# Altium project JacdacRp2040DisplayEc30 125.PrjPCB
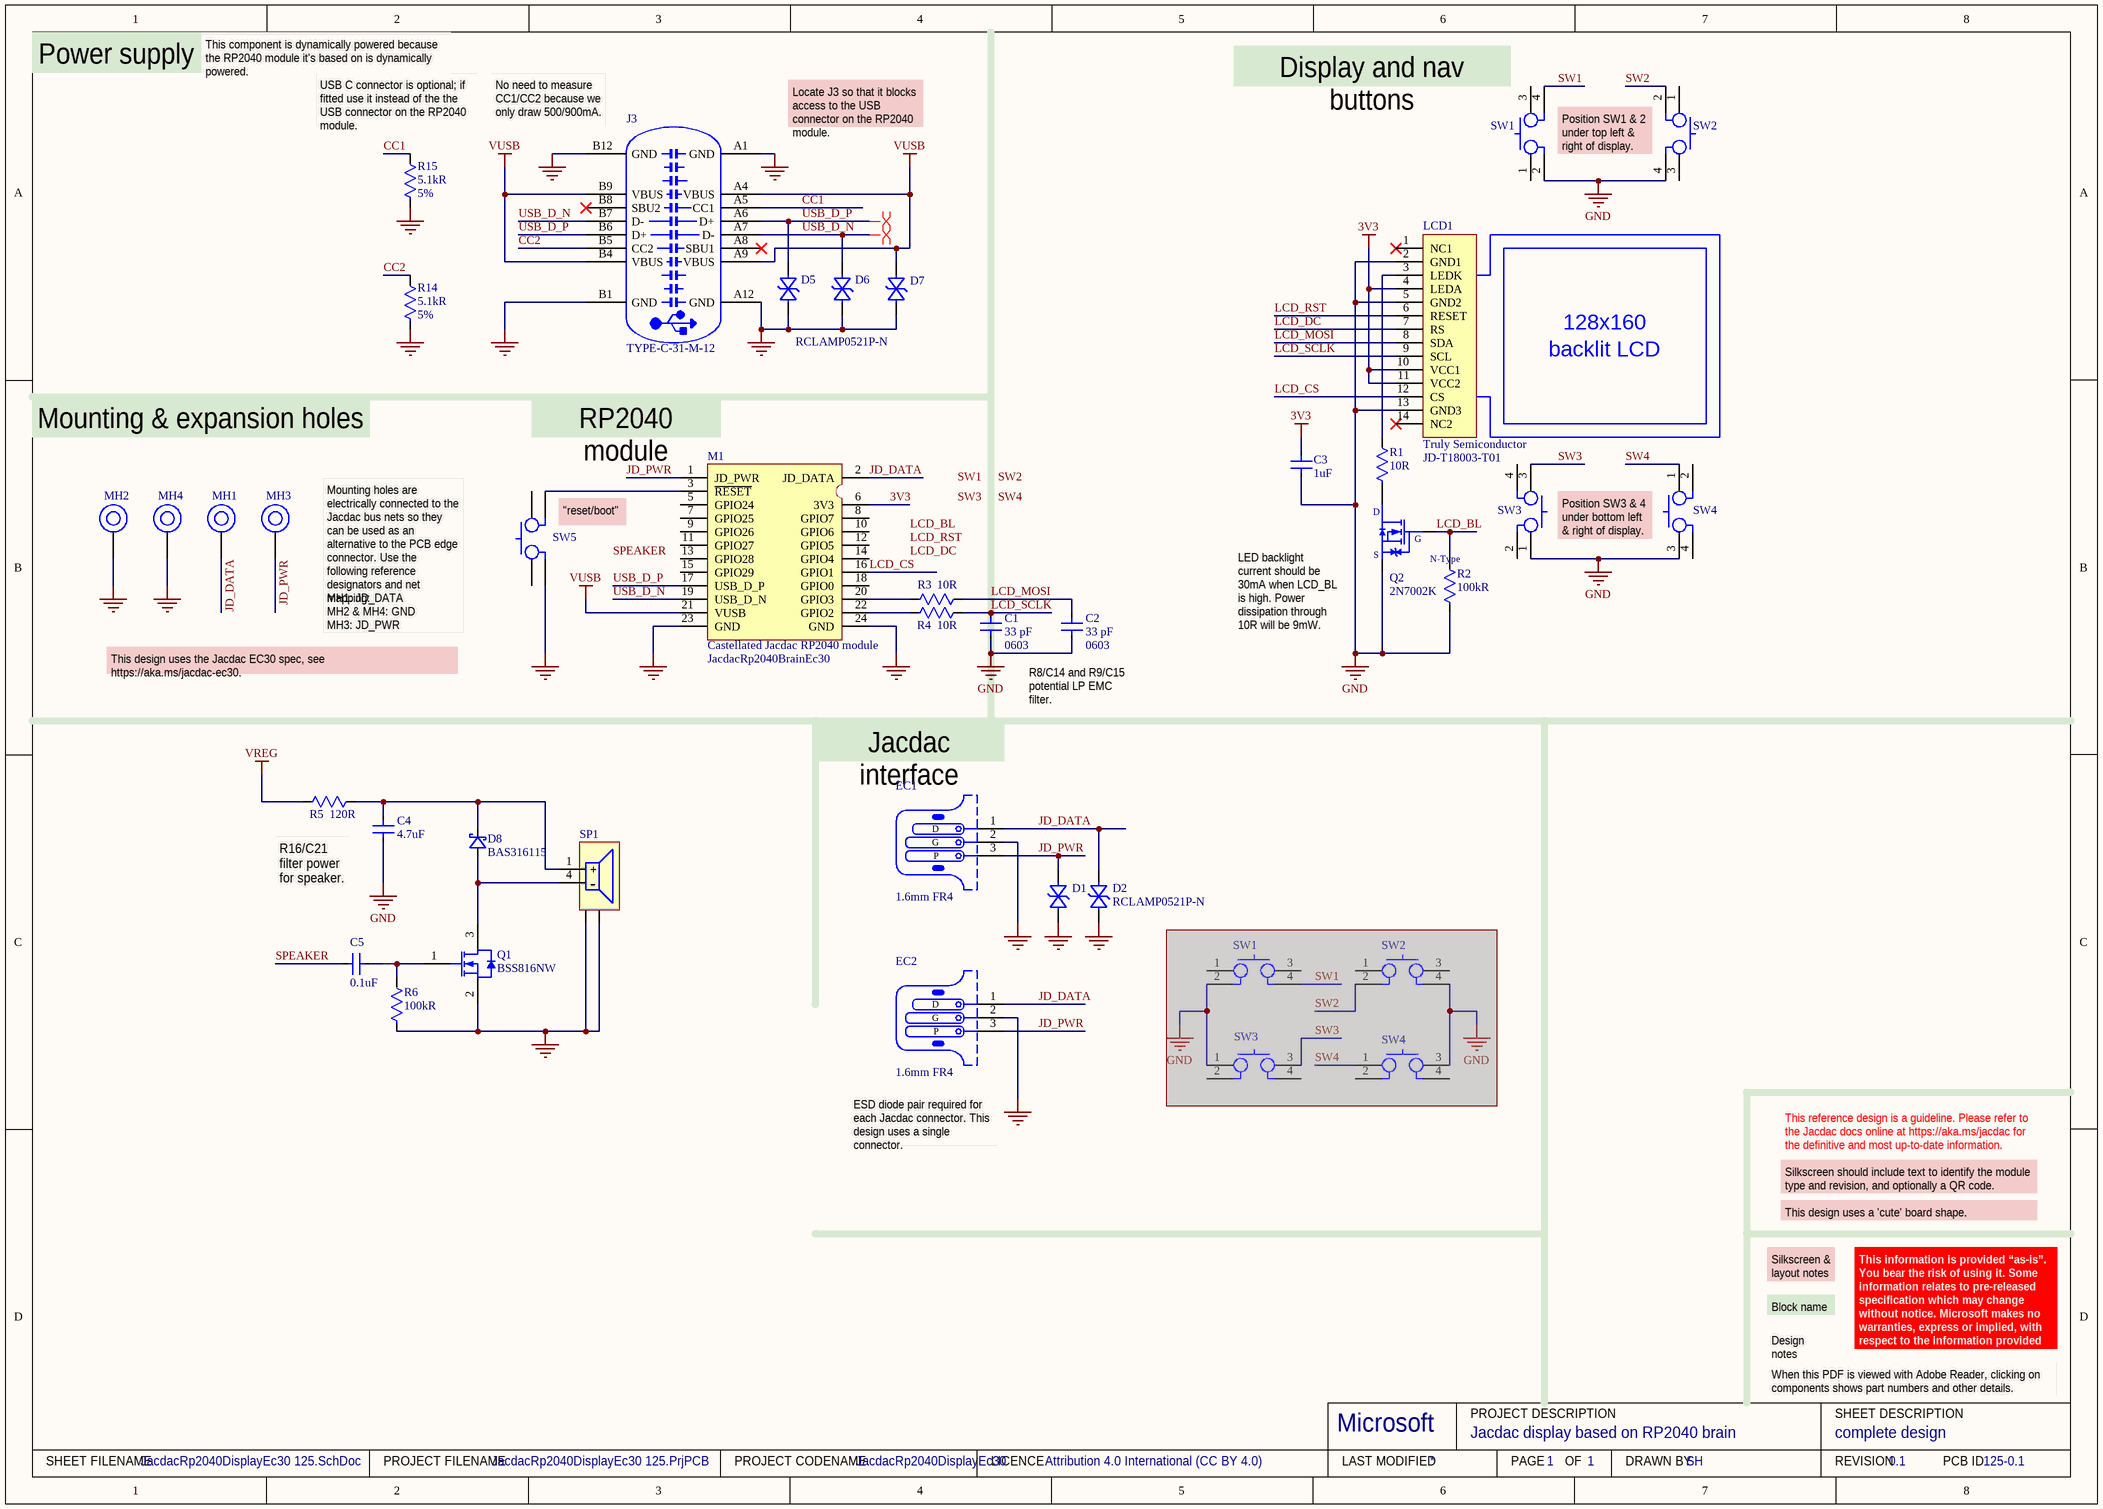
[diagram p0: JacdacRp2040DisplayEc30 125.SchDoc]
ProjectRevision: 0.1; ProjectLicenceTerms: Attribution 4.0 International (CC BY 4.0); ProjectDrawnBy: SH; ProjectCodenameID: 125; ProjectCodenameDescription: Jacdac display based on RP2040 brain; ProjectCodeName: JacdacRp2040DisplayEc30
1 sheet, 40 parts. Net scope: global (net labels, ports and power ports of the same name join across sheets).
Board file: JacdacRp2040DisplayEc30 125.PcbDoc

## Sheet JacdacRp2040DisplayEc30 125.SchDoc: complete design
size A3; DrawnBy: SH; DocumentNumber: 1; Revision: 0.1; SheetNumber: 1; SheetTotal: 1; VersionControl_RevNumber: 1

### Parts
(Parts that share a designator on the sheet are numbered #1, #2 ... from top to bottom, then left to right.)
C1  33 pF  Case/Package: 0603  [CC0603]
C2  33 pF  Case/Package: 0603  [CC0603]
C3  value 1uF  [CAP0603]  (hidden comment: CAP0603_GENERIC)
C4  Capacitance: 4.7uF  [C0603 - without outline]  (hidden comment: CL10A475KP8NNNC)
C5  0.1uF  [CC0603]
D1  RCLAMP0521P-N  [TVS 0402 - L]  (value not drawn)
D2  RCLAMP0521P-N  [TVS 0402 - L]
D5  RCLAMP0521P-N  [TVS 0402 - L]  (value not drawn)
D6  RCLAMP0521P-N  [TVS 0402 - L]  (value not drawn)
D7  RCLAMP0521P-N  [TVS 0402 - L]
D8  Manufacturer Part Number 1: BAS316115  [NXP_SOD323]  (hidden comment: BAS316)
EC1  PCB Type: 1.6mm FR4  [JACDAC_EDGE_CONNECTOR_NO_TRACES]  (hidden comment: 3 pin JACDAC edge connector)  (no BOM)
EC2  PCB Type: 1.6mm FR4  [JACDAC_EDGE_CONNECTOR_NO_TRACES]  (hidden comment: 3 pin JACDAC edge connector)  (no BOM)
J3  TYPE-C-31-M-12  [TYPE-C-31-M-12]
LCD1  Manufacturer: Truly Semiconductor  [JD-T18003-T01-BASIC-1.5mm-clearance]  (hidden comment: JD-T18003-T01)
M1  Castellated Jacdac RP2040 module  [JacdacRp2040BrainEc30]
MH1  MH_7.0MMK_4.4MMC_3.1MMD_PTH  [MH_7.0MMK_4.4MMC_3.1MMD_PTH]  (value not drawn)  (no BOM)
MH2  MH_7.0MMK_4.4MMC_3.1MMD_PTH  [MH_7.0MMK_4.4MMC_3.1MMD_PTH]  (value not drawn)  (no BOM)
MH3  MH_7.0MMK_4.4MMC_3.1MMD_PTH  [MH_7.0MMK_4.4MMC_3.1MMD_PTH]  (value not drawn)  (no BOM)
MH4  MH_7.0MMK_4.4MMC_3.1MMD_PTH  [MH_7.0MMK_4.4MMC_3.1MMD_PTH]  (value not drawn)  (no BOM)
Q1  Manufacturer Part Number 1: BSS816NW  [INFINEON_SOT-323]  (hidden comment: MOSFET N-CH 20V 1.4A)
Q2  2N7002K  [SOT23-ONS]
R1  value 10R  [CC0603]  (hidden comment: RES0603_GENERIC)
R2  value 100kR  [CC0603]  (hidden comment: RES0603_GENERIC)
R3  value 10R  [CC0603]  (hidden comment: RES0603_GENERIC)
R4  value 10R  [CC0603]  (hidden comment: RES0603_GENERIC)
R5  value 120R  [CC0603]  (hidden comment: RES0603_GENERIC)
R6  value 100kR  [CC0603]  (hidden comment: RES0603_GENERIC)
R14  value 5.1kR  Tolerance: 5%  [CC0603]  (hidden comment: RES0603_GENERIC)
R15  value 5.1kR  Tolerance: 5%  [CC0603]  (hidden comment: RES0603_GENERIC)
SP1  SPEAKER_MLT-8530  [SPEAKER_MLT-8530]  (value not drawn)
SW1#1  PTS525SM15SMTR2LFS  [PTS525Sx15]  (value not drawn)
SW1#2  PTS525SM15SMTR2LFS  [PTS525Sx15]  (value not drawn)  (masked out: inside a compile mask, not in the netlist)
SW2#1  PTS525SM15SMTR2LFS  [PTS525Sx15]  (value not drawn)
SW2#2  PTS525SM15SMTR2LFS  [PTS525Sx15]  (value not drawn)  (masked out: inside a compile mask, not in the netlist)
SW3#1  PTS525SM15SMTR2LFS  [PTS525Sx15]  (value not drawn)
SW3#2  PTS525SM15SMTR2LFS  [PTS525Sx15]  (value not drawn)  (masked out: inside a compile mask, not in the netlist)
SW4#1  PTS525SM15SMTR2LFS  [PTS525Sx15]  (value not drawn)
SW4#2  PTS525SM15SMTR2LFS  [PTS525Sx15]  (value not drawn)  (masked out: inside a compile mask, not in the netlist)
SW5  UK-B0267-SP25Y  [USAKRO-UK-B0267-SP25Y]  (value not drawn)

### Nets
3V3: C3.2 LCD1.4(LEDA) LCD1.10(VCC1) LCD1.11(VCC2) M1.6(3V3)
GND: C1.1 C2.1 C3.1 C4.1 D1.2(A) D2.2(A) D5.2(A) D6.2(A) D7.2(A) EC1.2(G) EC2.2(G) J3.A1(GND) J3.A12(GND) J3.B1(GND) J3.B12(GND) LCD1.2(GND1) LCD1.5(GND2) LCD1.13(GND3) M1.23(GND) M1.24(GND) MH2.1 MH4.1 Q1.2(S) Q2.2(S) R2.2 R6.2 R14.2 R15.2 SP1.2(NC) SP1.3(NC) SW1#1.2 SW2#1.4 SW3#1.1 SW4#1.3 SW5.4
VREG: R5.2
VUSB: D7.1(K) J3.A4(VBUS) J3.A9(VBUS) J3.B4(VBUS) J3.B9(VBUS) M1.21(VUSB)
CC1: J3.A5(CC1) R15.1
CC2: J3.B5(CC2) R14.1
JD_DATA: D2.1(K) EC1.1(D) EC2.1(D) M1.2(JD_DATA) MH1.1
JD_PWR: D1.1(K) EC1.3(P) EC2.3(P) M1.1(JD_PWR) MH3.1
LCD_BL: Q2.1(G) R2.1
LCD_CS: LCD1.12(CS) M1.16(GPIO1)
LCD_DC: LCD1.7(RS)
LCD_MOSI: C2.2 LCD1.8(SDA) R3.1
LCD_RST: LCD1.6(RESET)
LCD_SCLK: C1.2 LCD1.9(SCL) R4.1
SPEAKER: C5.1
SW1: SW1#1.4
SW2: SW2#1.2
SW3: SW3#1.3
SW4: SW4#1.1
USB_D_N: D6.1(K) J3.A7(D-) J3.B7(D-) M1.19(USB_D_N)
USB_D_P: D5.1(K) J3.A6(D+) J3.B6(D+) M1.17(USB_D_P)
NetC4_2: C4.2 D8.1(K) R5.1 SP1.1(+)
NetC5_2: C5.2 Q1.1(G) R6.1
NetD8_2: D8.2(A) Q1.3(D) SP1.4(-)
NetLCD1_3: LCD1.3(LEDK) R1.1
NetM1_3: M1.3(~{RESET}) SW5.2
NetM1_20: M1.20(GPIO3) R3.2
NetM1_22: M1.22(GPIO2) R4.2
NetQ2_3: Q2.3(D) R1.2

Not connected (* = marked no-connect by the designer): J3 A8(SBU1)* B8(SBU2)*; LCD1 1(NC1)* 14(NC2)*; M1 5(GPIO24) 7(GPIO25) 8(GPIO7) 9(GPIO26) 10(GPIO6) 11(GPIO27) 12(GPIO5) 13(GPIO28) 14(GPIO4) 15(GPIO29) 18(GPIO0); SW1#1 1 3; SW2#1 1 3; SW3#1 2 4; SW4#1 2 4; SW5 1 3

### Layout directives
differential pair: USB_D_N, USB_D_P

### Notes on the sheet
- Power supply
- This component is dynamically powered because the RP2040 module it's based on is dynamically powered.
- (near SW1#1) Display and nav buttons
- (near R15) USB C connector is optional; if fitted use it instead of the the USB connector on the RP2040 module.
- (near J3) No need to measure CC1/CC2 because we only draw 500/900mA.
- Locate J3 so that it blocks access to the USB connector on the RP2040 module.
- Position SW1 & 2 under top left & right of display.
- Mounting & expansion holes
- (near M1) RP2040 module
- Mounting holes are electrically connected to the Jacdac bus nets so they can be used as an alternative to the PCB edge connector. Use the following reference designators and net mapping:
- (near SW5) "reset/boot"
- Position SW3 & 4 under bottom left & right of display.
- MH1: JD_DATA
  MH2 & MH4: GND
  MH3: JD_PWR
- (near Q2) LED backlight current should be 30mA when LCD_BL is high. Power dissipation through 10R will be 9mW.
- This design uses the Jacdac EC30 spec, see https://aka.ms/jacdac-ec30.
- R8/C14 and R9/C15 potential LP EMC filter.
- Jacdac interface
- R16/C21 filter power for speaker.
- ESD diode pair required for each Jacdac connector. This design uses a single connector.
- Silkscreen should include text to identify the module type and revision, and optionally a QR code.
- This reference design is a guideline. Please refer to the Jacdac docs online at https://aka.ms/jacdac for the definitive and most up-to-date information.
- This design uses a 'cute' board shape.
- Block name
- Silkscreen & layout notes
- Design notes
- When this PDF is viewed with Adobe Reader, clicking on components shows part numbers and other details.
- This information is provided “as-is”. You bear the risk of using it. Some information relates to pre-released specification which may change without notice. Microsoft makes no warranties, express or implied, with respect to the information provided here.
- Labels drawn without touching a wire or pin: LCD_BL, LCD_DC, LCD_RST, SPEAKER, SW1, SW2, SW3, SW4
- Microsoft
- PROJECT DESCRIPTION
- SHEET DESCRIPTION
- SHEET FILENAME
- PROJECT FILENAME
- PROJECT CODENAME
- LICENCE
- LAST MODIFIED
- PAGE
- OF
- DRAWN BY
- REVISION
- PCB ID
- (in symbol 2N7002K) N-Type
- (in symbol JD-T18003-T01) 128x160; backlit LCD

### Library data of the parts
C1 C2 = CC0603JRNPO9BN330: 33pF 0603 100V C0G/NPO; Manufacturer: Yageo; Dielectric: C0G; Tolerance: 5%; Supplier 1: Digi-Key; Manufacturer Part Number: CC0603JRNPO9BN330; RoHS: Yes; Category: Ceramic Capacitors; Mount: Surface Mount; Weight: 7.1E-05oz; Case Code (Imperial): 0603; Case Code (Metric): 1608; Min Operating Temperature: -55°C; Max Operating Temperature: 125°C; Capacitance: 33pF; Termination: SMD/SMT; Composition: Ceramic; Packaging: Tape and Reel; Voltage Rating: 100V; Voltage Rating (DC): 100V; Length: 1.6mm; Height: 0.8mm; Thickness: 0.035inch; Depth: 0.8mm; Width: 0.8mm; Lead Free: Lead Free; ComponentLink1URL: https://datasheet.ciiva.com/13207/upy-gp-np0-16v-to-50v-8-13207786.pdf; ComponentLink1Description: Online datasheet; Manufacturer 1: Yageo; Manufacturer Part Number 1: CC0603JRNPO9BN330
C3 = CAP0603_GENERIC: CAP generic 0603 SMD; Rated Voltage: * V; Package Size: 0603
C4 = CL10A475KP8NNNC: CAP CER 4.7UF 10V X5R 0603; Manufacturer: Samsung; Tolerance: 10%; Supplier 1: Farnell; Manufacturer Part Number: CL10A475KP8NNNC; RoHS: Yes; Category: Ceramic Capacitors; Stock 1: 75690; Pricing 1: 10=0.02700, 100=0.02160, 500=0.01580, 1000=0.01310, 2000=0.01130 (GBP); Mount: Surface Mount; Case/Package: 0603; Case Code (Metric): 1608; Contact Plating: Tin; Min Operating Temperature: -55°C; Max Operating Temperature: 85°C; Dielectric: X5R; Package Quantity: 1; Packaging: Tape and Reel; Series: CL; Construction: Flat; Length: 1.6mm; Width: 0.031inch; Height: 0.8mm; Thickness: 0.035inch; Depth: 0.8mm; Radiation Hardening: No; RoHS Compliant: Yes; ComponentLink1URL: https://datasheet.ciiva.com/25797/cl10a475kp8nnnc-25797520.pdf; ComponentLink1Description: Online datasheet; Supplier 2: Digi-Key; Pricing 2: 1=0.10000, 10=0.04900, 50=0.02680, 100=0.02180, 500=0.01558, 1000=0.01224 (USD); Supplier Part Number 2: 1276-1044-1-ND; Supplier Part Number 1: 3013398; Created By: D Gakure; Checked By: ?; Voltage Rating: 10V; Case Code (Imperial): 0603
C5 = CC0603KRX7R8BB104: 0.1uF, 0603, CC0603KRX7R8BB104, Yageo, 25V, X7R, 10%, FULL REEL; Capacitance: 100nF; Supplier 1: Digi-Key; Manufacturer: Yageo; Manufacturer Part Number: CC0603KRX7R8BB104; RoHS: Yes; Category: Ceramic Capacitors; Stock 1: 12615855; Pricing 1: 1=0.10000, 10=0.05300, 100=0.02340, 500=0.01674, 1000=0.01316 (USD); Mount: Surface Mount; Case/Package: 0603; Number of Pins: 2; Case Code (Imperial): 0603; Case Code (Metric): 1608; Min Operating Temperature: -55°C; Max Operating Temperature: 125°C; Tolerance: 10%; Dielectric: X7R; Voltage Rating: 25V; Packaging: Tape and Reel; Package Quantity: 1; Voltage Rating (DC): 25V; Termination: SMD/SMT; Composition: Ceramic; Voltage: 25V; Length: 1.6mm; Height: 0.8mm; Width: 0.8mm; Thickness: 0.035inch; Depth: 0.8mm; Radiation Hardening: No; REACH SVHC: Unknown; Lead Free: Lead Free; Halogen Free: Halogen Free; ComponentLink2URL: https://datasheet.ciiva.com/144/mlccorderingcode-144075.pdf?src-supplier=Digi-Key; ComponentLink2Description: Online part number coding; ComponentLink3URL: https://datasheet.ciiva.com/17434/upy-gphc-x7r-6-3v-to-50v-8-17434263.pdf; ComponentLink3Description: Online datasheet; Supplier Part Number 1: 311-1341-1-ND
D1 D2 D5-D7 = RCLAMP0521P-N: Bidirectional 5V (Max) 6V 16V 3.5A (8/20us) 0402 TVS RoHS; Manufacturer: Born Semiconductor; Package: 0402; Created By: D Gakure; Checked By: ?; Supplier1: LCSC; Supplier1 Part Number: C316043; ComponentLink1Description: Online datasheet; ComponentLink1URL: https://datasheet.lcsc.com/szlcsc/Bourne-Semicon-Shenzhen-RCLAMP0521P-N_C316043.pdf; Manufacturer Part Number: RCLAMP0521P-N
D8 = BAS316: Diode: switching; SMD; 100V; 250mA; 4ns; SOD323; Manufacturer 1: NXP Semiconductors; Element Configuration: Single; Peak Non-Repetitive Surge Current: 4A; Forward Voltage: 1.25V; Max Reverse Leakage Current: 1uA; Max Power Dissipation: 400mW; Supplier 1: Digi-Key; RoHS: Yes; Category: Rectifier Diodes; Mount: Surface Mount; Case/Package: SC; Number of Pins: 2; Weight: 0.01lb; Contact Plating: Tin; Min Operating Temperature: -65°C; Max Operating Temperature: 150°C; Packaging: Tape and Reel; Reverse Recovery Time: 4ns; Package Quantity: 1; Forward Current: 250mA; Max Repetitive Reverse Voltage (Vrrm): 100V; Max Surge Current: 4A; Recovery Time: 4ns; Average Rectified Current: 250mA; Max Reverse Voltage (DC): 100V; Max Forward Surge Current (Ifsm): 4A; Power Dissipation: 400mW; Voltage: 100V; Length: 0.25inch; Height: 0.25inch; Width: 0.25inch; Radiation Hardening: No; Lead Free: Lead Free; REACH SVHC: No SVHC; ComponentLink1URL: https://datasheet.ciiva.com/1242/1856332-1242585.pdf; ComponentLink1Description: NXP datasheet online; Supplier 2: Farnell; Supplier Part Number 1: 568-5003-2-ND; Supplier Part Number 2: 2336750
EC1 EC2 = Jacdac edge connector: 3 pin Jacdac edge connector 1.27mm pitch; Manufacturer Part Number: JACDAC_EDGE_CONNECTOR; Checked By: ?; Created By: D. Gakure; ComponentLink1Description: Yuliang JACDAC cable connector drawing online; ComponentLink1URL: https://github.com/microsoft/jacdac-mdk/blob/main/connector/JACDAC-Connector-by-Yuliang-2020-11-28.pdf; ComponentLink2Description: JACDAC PCB edge connector spec onlin; ComponentLink2URL: https://github.com/microsoft/jacdac-mdk/blob/main/connector/JACDAC_PCB_Edge_Connector_Drawing_JD-PEC-01_rev_01.pdf
J3 = TYPE-C-31-M-12: USB - Type C Female 16 USB Connectors RoHS; Manufacturer: Korean Hroparts Elec; Gender: Receptacle; Number of Positions: 16; RoHS: Yes; Category: USB Connectors; Orientation: Right Angle; ComponentLink1URL: https://datasheet.lcsc.com/szlcsc/1811131825_Korean-Hroparts-Elec-TYPE-C-31-M-12_C165948.pdf; ComponentLink1Description: Online datasheet; Supplier 1 Part Number: C165948; Supplier 1: LCSC; Manufacturer Part Number: TYPE-C-31-M-12
LCD1 = JD-T18003-T01: 128x160 backlit colour LCD; ComponentLink1Description: Truly Semiconductor datasheet; ComponentLink1URL: https://cdn-shop.adafruit.com/datasheets/JD-T1800.pdf; ComponentLink2Description: Adafruit product page; ComponentLink2URL: https://www.adafruit.com/product/618; Supplier 1: Digi-Key; Stock 1: 65; Pricing 1: 1=9.95 (USD); Supplier 2: Mouser; Supplier 3: Adafruit; Supplier Part Number 3: 618; Supplier Part Number 2: 485-618; Supplier Part Number 1: 1528-2562-ND; Manufacturer Part Number: JD-T18003-T01
M1 = JacdacRP2040BrainEC30: Part Number: JacdacRp2040BrainEc30
MH1-MH4 = MH_7.0MMK_4.4MMC_3.1MMD_PTH: Mounting Hole 7.0mm keepout, 4.4mm annualar ring and 3.1mm Drill PTH; Hole Size: M3; Hole Diameter: 3.1mm; Hole Type: PTH; Annular Ring: 4.4mm; Hole Clearance: 7.0mm
Q1 = BSS816NWH6327XTSA1CT-ND: Trans MOSFET N-CH 20V 1.4A Automotive 3-Pin SOT-323 T/R; Manufacturer 1: Infineon; Rds On Max: 160mR; Supplier 1: Digi-Key; RoHS: No; Stock 1: 9959; Pricing 1: 1=0.38000, 10=0.31500, 25=0.26360, 100=0.12890, 250=0.12688, 500=0.10754, 1000=0.07472 (USD); Number of Pins: 3; Packaging: Tape and Reel; Drain to Source Voltage (Vdss): 20V; Max Dual Supply Voltage: 20V; Halogen Free: Halogen Free; Supplier 2: Farnell; Supplier 3: Mouser; Supplier 4: RSComponents; Supplier Part Number 2: 2617470; Supplier Part Number 3: 726-BSS816NWH6327; Supplier Part Number 4: 1107113; Supplier Part Number 1: BSS816NWH6327XTSA1CT-ND
Q2 = 2N7002K: MOSFET Transistor, N Channel, 300 mA, 60 V, 2 ohm, 10 V, 2.5 V; Manufacturer: ON Semiconductor / Fairchild; Max Power Dissipation: 350mW; Continuous Drain Current (ID): 300mA; Input Capacitance: 50pF; Number of Elements: 1; Rds On Max: 2R; Drain to Source Breakdown Voltage: 60V; Threshold Voltage: 2.5V; Element Configuration: Single; Gate to Source Voltage (Vgs): 20V; Turn-Off Delay Time: 30ns; Turn-On Delay Time: 5ns; Polarity: N-CHANNEL; Supplier 1: Digi-Key; Stock 1: 53564; Pricing 1: 1=0.40000, 10=0.32500, 25=0.27240, 100=0.17240, 500=0.11344, 1000=0.07714 (USD); Case/Package: SOT-23; Number of Pins: 3; Contact Plating: Tin,Matte; Min Operating Temperature: -55°C; Max Operating Temperature: 150°C; Packaging: Tape and Reel; Power Dissipation: 350mW; Package Quantity: 1; Drain to Source Resistance: 2R; On-State Resistance: 2R; Length: 2.92mm; Height: 1.2mm; Width: 1.3mm; Radiation Hardening: No; Lead Free: Lead Free; REACH SVHC: No SVHC; Supplier 2: Mouser; ComponentLink1Description: Online datasheet; ComponentLink1URL: https://www.onsemi.com/pdf/datasheet/2n7002k-d.pdf; Supplier Part Number 2: 512-2N7002K; Supplier Part Number 1: 2N7002KCT-ND; Manufacturer Part Number: 2N7002K; Supplier 3: Farnell; Supplier Part Number 3: 2453382; Category: MOSFETs; Checked By: ?; Created By: D. Gakure; Drain-source On Resistance-Max: 2R; Drain to Source Voltage (Vdss): 60V; Mount: Surface Mount; Pricing 2: 1=0.40000, 10=0.27300, 50=0.27300, 100=0.13400, 1000=0.07800, 10000=0.05100 (USD); Pricing 3: 5=0.34800, 10=0.23500, 100=0.09100, 500=0.05850, 3000=0.04630, 9000=0.03860, 24000=0.03750, 45000=0.03530 (GBP); RoHS: Yes; Stock 2: 111825; Stock 3: 101059; Voltage: 60V
R1-R6 = RES0603_GENERIC: Generic 0603 resistor; Power: *mW; Tolerance: *%; Package Size: 0603; Manufacturer: Generic
R14 R15 = RES0603_GENERIC: Generic 0603 resistor; Power: *mW; Package Size: 0603; Manufacturer: Generic
SP1 = MLT-8530: 8.5mm MAGNETIC SMD SPEAKER; Manufacturer 1: JIANGSU HUANENG; Manufacturer Part Number 1: MLT-8530; Manufacturer 2: TAT ELECTRONICS; Manufacturer Part Number 2: BM8530S-0327-16; Manufacturer 3: DONGGUAN COSSON; Manufacturer Part Number 3: KS-085030H-03027; ComponentLink1Description: Jiangsu datasheet online (lcsc.com); ComponentLink1URL: https://datasheet.lcsc.com/szlcsc/1811151451_Jiangsu-Huaneng-Elec-MLT-8530_C94599.pdf; ComponentLink2Description: Jiangsu datasheet online (seeedstudio.com); ComponentLink2URL: https://files.seeedstudio.com/products/107020109/document/MLT_8530_datasheet.pdf; Manufacturer Part Number: MLT-8530; Manufacturer: JIANGSU HUANENG
SW1#1 SW1#2 SW2#1 SW2#2 SW3#1 SW3#2 SW4#1 SW4#2 = PTS525SM15SMTR2LFS: Switch Tactile N.O. SPST Round Button Gull Wing 0.02A 15VDC 1000000Cycles 1.569N SMD T/R; Manufacturer 1: ITT C&K; Actuator Material: Nylon,Polyamide; Illumination Type: Non-Illuminated; Operating Force: 160gf; Switch Travel: 0.25mm; Switch Function: Off-Mom; Actuator Type: Standard; Supplier 1: Digi-Key; Manufacturer Part Number 1: PTS525SM15SMTR2LFS; RoHS: Yes; Category: Tactile Switches; Stock 1: 314519; Pricing 1: 1=0.62000, 10=0.59400, 25=0.57240, 100=0.49540, 250=0.45136, 500=0.41834, 1000=0.37431 (USD); Mount: Surface Mount; Mechanical Life: 1000000Cycles; Min Operating Temperature: -20°C; Max Operating Temperature: 70°C; Packaging: Cut Tape; Termination: Gull Wing; Throw Configuration: SPST; Lead Free: Lead Free; RoHS Compliant: Yes; ComponentLink2URL: https://www.ckswitches.com/media/1467/pts525.pdf; ComponentLink2Description: online datasheet; Supplier 2: Farnell; Supplier 3: Mouser; Supplier Part Number 3: 611-PTS525SM15SMTR2; Supplier Part Number 2: 3023207; Supplier Part Number 1: CKN9104CT-ND; Manufacturer: ITT C&K; Manufacturer Part Number: PTS525SM15SMTR2LFS
SW5 = UK-B0267-SP25Y: SWITCH TACTILE SSPST 50mA @ 12VDC; Manufacturer: USAKRO; Operating Force: 3.9 N; Actuator: Oval; Contact Form: SPST; Switch Function: OFF - (ON); Product Category: Tactile Switches; RoHS: Details; Current Rating: 50 mA; Voltage Rating DC: 12 VDC; Mounting Style: SMD/SMT; Supplier 1: LCSC; ComponentLink1URL: https://datasheet.ciiva.com/18514/pts810-4mar13-18514167.pdf; ComponentLink1Description: Online datasheet; Supplier 1 Part Number: C493283; Manufacturer Part Number: UK-B0267-SP25Y